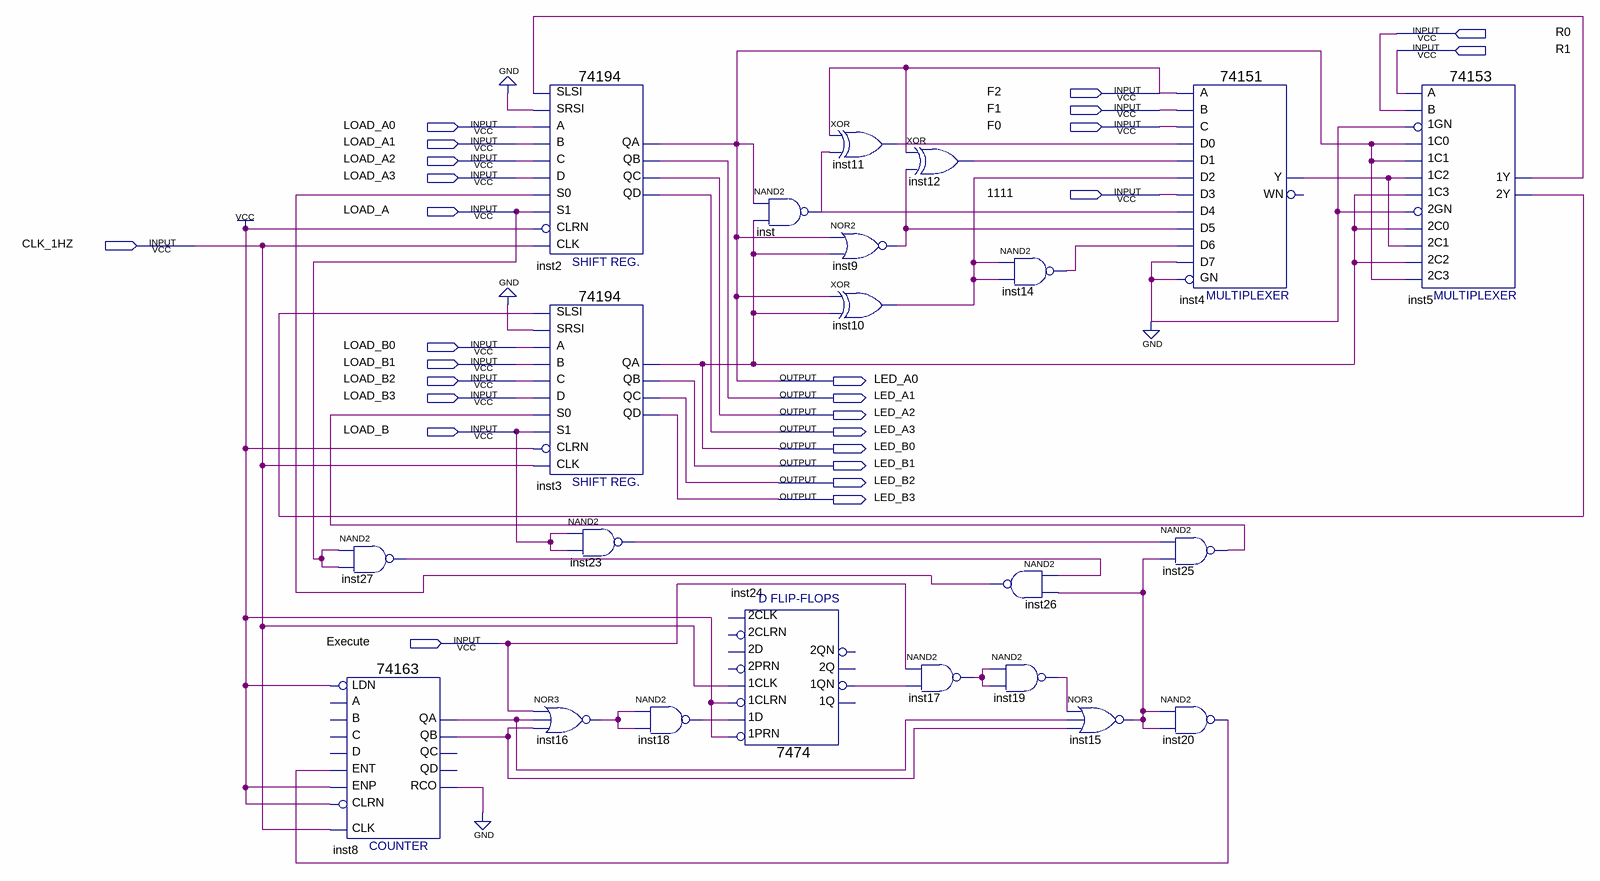
[diagram p0: schematic sheet]
// Quartus schematic lab2block_diagram.bdf as structural Verilog: 22 symbols, 26 pins
module lab2block_diagram (
  input  R0,
  input  R1,
  input  F2,
  input  F1,
  input  LOAD_A0,
  input  F0,
  input  LOAD_A1,
  input  LOAD_A2,
  input  LOAD_A3,
  input  \1111 ,
  input  LOAD_A,
  input  CLK_1HZ,
  input  LOAD_B0,
  input  LOAD_B1,
  input  LOAD_B2,
  input  LOAD_B3,
  input  LOAD_B,
  input  Execute,
  output LED_A0,
  output LED_A1,
  output LED_A2,
  output LED_A3,
  output LED_B0,
  output LED_B1,
  output LED_B2,
  output LED_B3
);

  wire inst4_y, inst5_1y, inst5_2y, inst8_qa, inst8_qb, inst8_rco, inst9_out, inst10_out, inst11_out,
       inst12_out, inst14_out, inst15_out, inst16_out, inst17_out, inst18_out, inst19_out, inst20_out,
       inst23_out, inst24_1qn, inst25_out, inst26_out, inst27_out, inst_out;

  nand inst27 (inst27_out, LOAD_A, LOAD_A);
  \74163  inst8 (
    .ENT(inst20_out), .CLRN(1'b1), .CLK(CLK_1HZ), .ENP(1'b1), .LDN(1'b1), .QA(inst8_qa), .QB(inst8_qb),
    .RCO(inst8_rco));  // open: C, B, A, D, QC, QD
  \74194  inst2 (
    .SLSI(inst5_1y), .SRSI(1'b0), .B(LOAD_A1), .C(LOAD_A2), .CLK(CLK_1HZ), .CLRN(1'b1), .D(LOAD_A3),
    .S1(LOAD_A), .S0(inst26_out), .A(LOAD_A0), .QA(LED_A0), .QB(LED_A1), .QC(LED_A2), .QD(LED_A3));
  \74194  inst3 (
    .SLSI(inst5_2y), .SRSI(1'b0), .B(LOAD_B1), .C(LOAD_B2), .CLK(CLK_1HZ), .CLRN(1'b1), .D(LOAD_B3),
    .S1(LOAD_B), .S0(inst25_out), .A(LOAD_B0), .QA(LED_B0), .QB(LED_B1), .QC(LED_B2), .QD(LED_B3));
  nor inst16 (inst16_out, Execute, inst8_qa, inst8_qb);
  nand inst23 (inst23_out, LOAD_B, LOAD_B);
  nand inst18 (inst18_out, inst16_out, inst16_out);
  nand inst (inst_out, LED_A0, LED_B0);
  \7474  inst24 (
    .\1CLK (CLK_1HZ), .\1D (inst18_out), .\1PRN (1'b1), .\1CLRN (1'b1), .\1QN (inst24_1qn));  // open: 2D, 2PRN, 2CLK, 2CLRN, 2Q, 2QN, 1Q
  xor inst11 (inst11_out, F2, inst_out);
  nor inst9 (inst9_out, LED_A0, LED_B0);
  xor inst10 (inst10_out, LED_A0, LED_B0);
  xor inst12 (inst12_out, F2, inst9_out);
  nand inst17 (inst17_out, Execute, inst24_1qn);
  nand inst14 (inst14_out, inst10_out, inst10_out);
  nand inst26 (inst26_out, inst27_out, inst15_out);
  nand inst19 (inst19_out, inst17_out, inst17_out);
  nor inst15 (inst15_out, inst19_out, inst8_qa, inst8_qb);
  nand inst25 (inst25_out, inst23_out, inst15_out);
  nand inst20 (inst20_out, inst15_out, inst15_out);
  \74151  inst4 (
    .GN(1'b0), .C(F0), .B(F1), .A(F2), .D5(inst9_out), .D0(inst11_out), .D1(inst12_out), .D4(inst_out),
    .D3(\1111 ), .D2(inst10_out), .D6(inst14_out), .D7(1'b0), .Y(inst4_y));  // open: WN
  \74153  inst5 (
    .\1C1 (LED_A0), .\1GN (1'b0), .\1C0 (LED_A0), .\2C0 (LED_B0), .\2GN (1'b0), .\2C2 (LED_B0),
    .\1C2 (inst4_y), .\1C3 (LED_B0), .B(R0), .A(R1), .\2C1 (inst4_y), .\2C3 (LED_A0), .\1Y (inst5_1y),
    .\2Y (inst5_2y));
  // also tied to GND on the sheet: inst8_rco
endmodule
